# Altium schematic sheet cover.SchDoc: Cover
size A4; Organization: GPA Robotics; DocumentNumber: 1; SheetNumber: 1; SheetTotal: 4
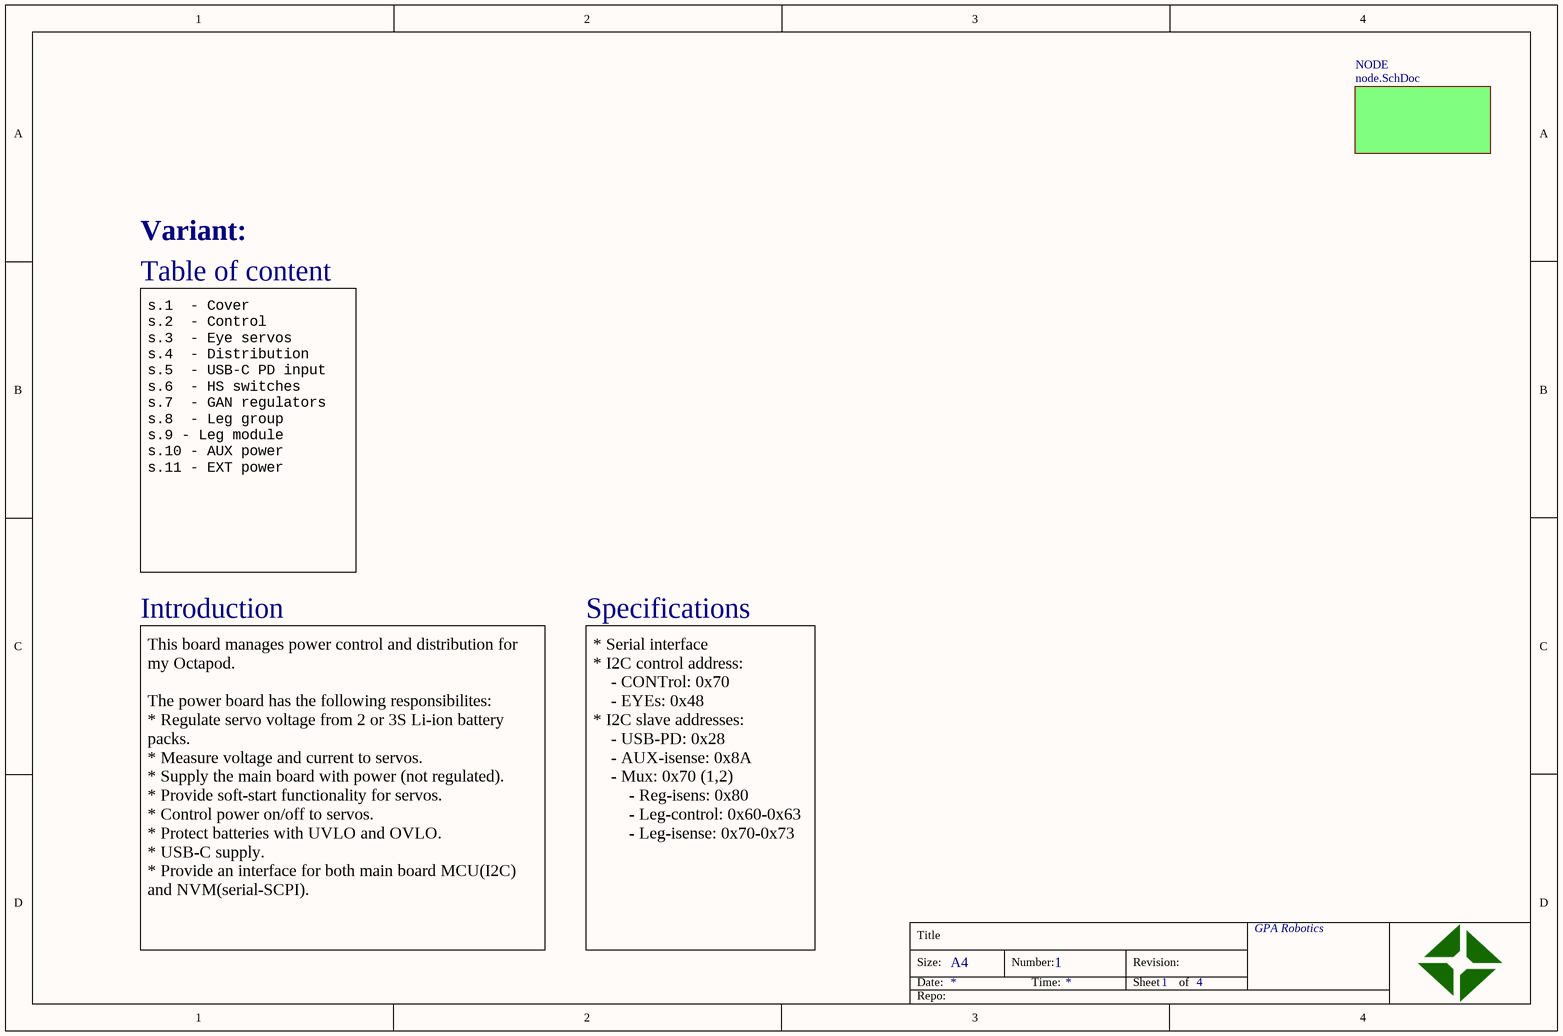
[diagram p0: cover.SchDoc]

## Sub-sheets
NODE = node.SchDoc: no entries

## Notes on the sheet
- Table of content
- s.1  - Cover
  s.2  - Control
  s.3  - Eye servos
  s.4  - Distribution
  s.5  - USB-C PD input
  s.6  - HS switches
  s.7  - GAN regulators
  s.8  - Leg group
  s.9 - Leg module
  s.10 - AUX power
  s.11 - EXT power
- Introduction
- Specifications
- This board manages power control and distribution for my Octapod.
  The power board has the following responsibilites:
  * Regulate servo voltage from 2 or 3S Li-ion battery packs.
  * Measure voltage and current to servos.
  * Supply the main board with power (not regulated).
  * Provide soft-start functionality for servos.
  * Control power on/off to servos.
  * Protect batteries with UVLO and OVLO.
  * USB-C supply.
  * Provide an interface for both main board MCU(I2C) and NVM(serial-SCPI).
- * Serial interface
  * I2C control address:
  - CONTrol: 0x70
  - EYEs: 0x48
  * I2C slave addresses:
  - USB-PD: 0x28
  - AUX-isense: 0x8A
  - Mux: 0x70 (1,2)
  - Reg-isens: 0x80
  - Leg-control: 0x60-0x63
  - Leg-isense: 0x70-0x73
- Variant:
- Title
- Size:
- Date:
- A4
- Number:
- Time:
- Revision:
- Sheet
- of
- Repo: